# Altium schematic sheet MCU.SchDoc: Title
size A3; Date: Date; CompanyName: Integrated Micro-Electronics Bulgaria; Organization: Design & Development Department; Address1: Drawing Type; Address2: Address 1; Address3: Address 2; Address4: Address 3; DocumentNumber: 730xxx; Revision: 01; SheetNumber: 1; SheetTotal: 1; PageSetup: Record=PageOptions|CenterHorizontal=True|CenterVertical=True|PrintScale=0.70|XCorrection=1.00|YCorrection=1.00|PrintKind=2|BorderSize=5000000|LeftOffset=0|BottomOffset=0|Orientation=2|PaperLength=1000|PaperWidth=1000|Scale=100|PaperSource=7|PrintQuality=-4|MediaType=1|DitherType=10|PaperKind=A4|PrintScaleMode=1; SheetSize: A3; Time: Time; ModifiedDate: Mod. Date
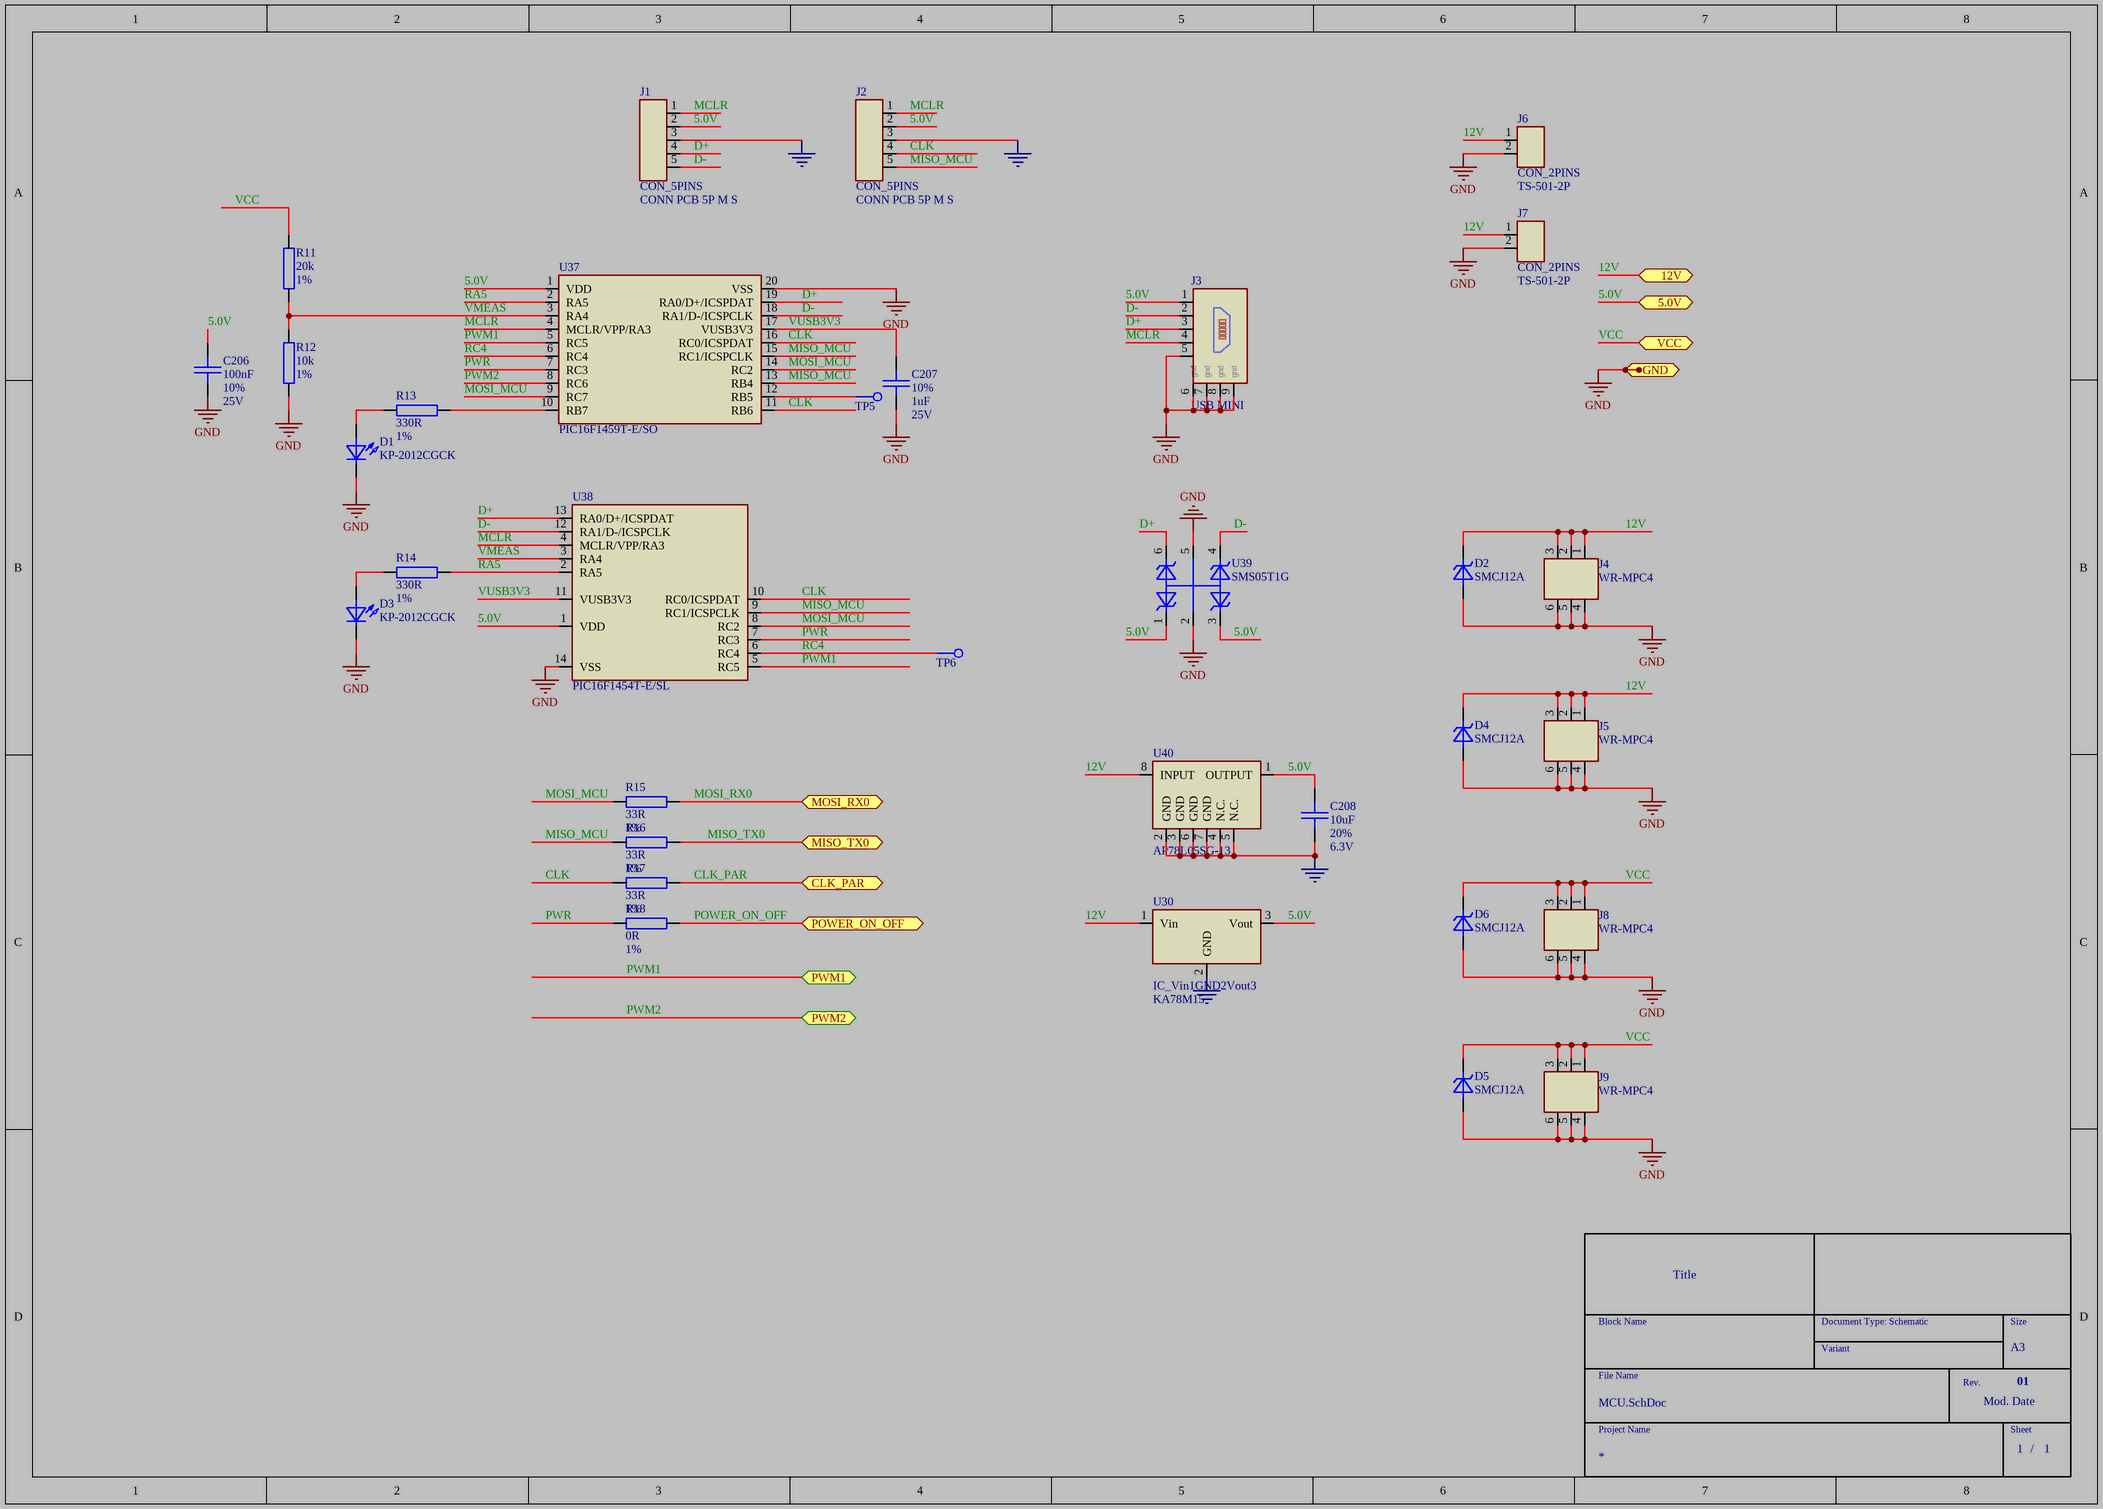
[diagram p0: MCU.SchDoc]

## Parts
C206  DB_VALUE: 100nF  DB_TOLERANCE: 10%  DB_VOLTAGE: 25V  [SMD_0402_CAPC1005X55N]  (hidden comment: C)
C207  DB_TOLERANCE: 10%  DB_VALUE: 1uF  DB_VOLTAGE: 25V  [SMD_0603_CAPC1608X80N]  (hidden comment: C)
C208  DB_VALUE: 10uF  DB_TOLERANCE: 20%  DB_VOLTAGE: 6.3V  [SMD_0603_CAPC1608X95N]  (hidden comment: C)
D1  DB_VALUE: KP-2012CGCK  [SMD_LED2012X100N]  (hidden comment: LED)
D2  DB_VALUE: SMCJ12A  [SMD_DO214AC_SMC]  (hidden comment: D_TVS_UNI)
D3  DB_VALUE: KP-2012CGCK  [SMD_LED2012X100N]  (hidden comment: LED)
D4  DB_VALUE: SMCJ12A  [SMD_DO214AC_SMC]  (hidden comment: D_TVS_UNI)
D5  DB_VALUE: SMCJ12A  [SMD_DO214AC_SMC]  (hidden comment: D_TVS_UNI)
D6  DB_VALUE: SMCJ12A  [SMD_DO214AC_SMC]  (hidden comment: D_TVS_UNI)
J1  CON_5PINS  DB_VALUE: CONN PCB 5P M S  [PTH_HDRV05W64P254_1X05]
J2  CON_5PINS  DB_VALUE: CONN PCB 5P M S  [PTH_HDRV05W64P254_1X05]
J3  DB_VALUE: USB MINI  [SMD_CON-CVILUX-CU04-SCM15B0]  (hidden comment: CON_USB_MINI_1)
J4  DB_VALUE: WR-MPC4  [PTH_CON_WR-MRC4-6P_S]  (hidden comment: CON_2ROWS_6PINS_1)
J5  DB_VALUE: WR-MPC4  [PTH_CON_WR-MRC4-6P_S]  (hidden comment: CON_2ROWS_6PINS_1)
J6  CON_2PINS  DB_VALUE: TS-501-2P  [PTH_HDRV02W11060P500_1X02]
J7  CON_2PINS  DB_VALUE: TS-501-2P  [PTH_HDRV02W11060P500_1X02]
J8  DB_VALUE: WR-MPC4  [PTH_CON_WR-MRC4-6P_S]  (hidden comment: CON_2ROWS_6PINS_1)
J9  DB_VALUE: WR-MPC4  [PTH_CON_WR-MRC4-6P_S]  (hidden comment: CON_2ROWS_6PINS_1)
R11  DB_VALUE: 20k  DB_TOLERANCE: 1%  [SMD_0603_RESC1608X55N]  (hidden comment: R)
R12  DB_VALUE: 10k  DB_TOLERANCE: 1%  [SMD_0402_RESC1005X37N]  (hidden comment: R)
R13  DB_VALUE: 330R  DB_TOLERANCE: 1%  [SMD_0603_RESC1608X55N]  (hidden comment: R)
R14  DB_VALUE: 330R  DB_TOLERANCE: 1%  [SMD_0603_RESC1608X55N]  (hidden comment: R)
R15  DB_VALUE: 33R  DB_TOLERANCE: 1%  [SMD_0402_RESC1005X37N]  (hidden comment: R)
R16  DB_VALUE: 33R  DB_TOLERANCE: 1%  [SMD_0402_RESC1005X37N]  (hidden comment: R)
R17  DB_VALUE: 33R  DB_TOLERANCE: 1%  [SMD_0402_RESC1005X37N]  (hidden comment: R)
R18  DB_VALUE: 0R  DB_TOLERANCE: 1%  [SMD_0603_RESC1608X55N]  (hidden comment: R)
TP5  TEST_POINT_1  [SMD_TP_100-254]  (value not drawn)
TP6  TEST_POINT_1  [SMD_TP_100-254]  (value not drawn)
U30  IC_Vin1GND2Vout3  DB_VALUE: KA78M15  [PTH_TO220]
U37  DB_VALUE: PIC16F1459T-E/SO  [SMD_SOIC127P1030X265-20N]  (hidden comment: IC_PIC16F1459)
U38  DB_VALUE: PIC16F1454T-E/SL  [SMD_SOIC127P600X175-14N]  (hidden comment: IC_PIC16F1454TESL-SO14)
U39  DB_VALUE: SMS05T1G  [SMD_SOT457_SOT95P275X110-6N]  (hidden comment: D_TVS_QUAD_C1A2C3C4A5C6)
U40  DB_VALUE: AP78L05SG-13  [SMD_SOIC127P600X175-8N]  (hidden comment: IC_LM2931AD-5.0R2G_SO-8)

## Ports
5.0V, 12V, CLK_PAR, GND, MISO_TX0, MOSI_RX0, POWER_ON_OFF, PWM1, PWM2, VCC

## Nets
GND: C206.2 C207.2 C208.2 D1.1(C) D2.2(A) D3.1(C) D4.2(A) D5.2(A) D6.2(A) J1.3 J2.3 J3.5 J3.6 J3.7 J3.8 J3.9 J4.4 J4.5 J4.6 J5.4 J5.5 J5.6 J6.2 J7.2 J8.4 J8.5 J8.6 J9.4 J9.5 J9.6 R12.2 U30.2(GND) U37.20(VSS) U38.14(VSS) U39.2 U39.5 U40.2(GND) U40.3(GND) U40.4(N.C.) U40.5(N.C.) U40.6(GND) U40.7(GND) ; port GND
5.0V: C206.1 C208.1 J1.2 J2.2 J3.1 U30.3(Vout) U37.1(VDD) U38.1(VDD) U39.1 U39.3 U40.1(OUTPUT) ; port 5.0V
12V: D2.1(C) D4.1(C) J4.1 J4.2 J4.3 J5.1 J5.2 J5.3 J6.1 J7.1 U30.1(Vin) U40.8(INPUT) ; port 12V
CLK: J2.4 R17.1 U37.11(RB6) U37.16(RC0/ICSPDAT) U38.10(RC0/ICSPDAT)
CLK_PAR: R17.2 ; port CLK_PAR
D+: J1.4 J3.3 U37.19(RA0/D+/ICSPDAT) U38.13(RA0/D+/ICSPDAT) U39.6
D-: J1.5 J3.2 U37.18(RA1/D-/ICSPCLK) U38.12(RA1/D-/ICSPCLK) U39.4
MCLR: J1.1 J2.1 J3.4 U37.4(MCLR/VPP/RA3) U38.4(MCLR/VPP/RA3)
MISO_MCU: J2.5 R16.1 U37.13(RB4) U37.15(RC1/ICSPCLK) U38.9(RC1/ICSPCLK)
MISO_TX0: R16.2 ; port MISO_TX0
MOSI_MCU: R15.1 U37.9(RC7) U37.14(RC2) U38.8(RC2)
MOSI_RX0: R15.2 ; port MOSI_RX0
POWER_ON_OFF: R18.2 ; port POWER_ON_OFF
PWM1: U37.5(RC5) U38.5(RC5) ; port PWM1
PWM2: U37.8(RC6) ; port PWM2
PWR: R18.1 U37.7(RC3) U38.7(RC3)
RA5: R14.2 U37.2(RA5) U38.2(RA5)
RC4: TP6.1 U37.6(RC4) U38.6(RC4)
VCC: D5.1(C) D6.1(C) J8.1 J8.2 J8.3 J9.1 J9.2 J9.3 R11.1 ; port VCC
VMEAS: R11.2 R12.1 U37.3(RA4) U38.3(RA4)
VUSB3V3: C207.1 U37.17(VUSB3V3) U38.11(VUSB3V3)
NetD1_2: D1.2(A) R13.1
NetD3_2: D3.2(A) R14.1
NetR13_2: R13.2 U37.10(RB7)
NetTP5_1: TP5.1 U37.12(RB5)

## Notes on the sheet
- Block Name
- Document Type: Schematic
- Size
- File Name
- Variant
- Rev.
- Project Name
- Sheet
- /
- (in symbol CON000000048) gnd

## Library data of the parts
C206 = CAP000047469: DB_PART_TYPE: Ceramic_SMD\Standard_X5R; DB_MANUFACTURER_PART: SAMSUNG    CL05A104KA5NNNC; NOTE: <NOTE>; DB_T_RANGE: -55 to 85; DB_PACKAGE: 0402; DB_DESCRIPTION: C X5R 100nF 10% 25V 0402; DB_APPROVED_BY: VSN; DB_STATUS: NEW; DB_PART_NUMBER: CAP000047469; DB_PCB_DEVICE: SMD_0402_CAPC1005X55N; DB_APPROVED_ON: 08.03.2016 08:26:43; DB_DATASHEET: http://john.epiqdesign.com/projects/CIS_Datasheets/CAP_CL05A104KA5NNNC_100nF_X5R_25V_10_0402_Samsung.pdf?rev=1997&sc=0
C207 = CAP000047176: DB_MANUFACTURER_PART: TDK      CGA3E1X7R1E105KT; DB_PART_TYPE: Ceramic_SMD\Standard_X7R; NOTE: <NOTE>; DB_APPROVED_BY: VSN; DB_CERTIFIED: AUT; DB_DESCRIPTION: C X7R 1uF 10% 25V 0603; DB_PACKAGE: 0603; DB_STATUS: NEW; DB_T_RANGE: -55 to 125; DB_APPROVED_ON: 12.03.2012 08:41:25; DB_DATASHEET: http://john.epiqdesign.com/projects/CIS_Datasheets/CGA4_automotive_TDK_B11.pdf?rev=502&sc=0; DB_PART_NUMBER: CAP000047176; DB_PCB_DEVICE: SMD_0603_CAPC1608X80N
C208 = CAP000043646: DB_MANUFACTURER_PART: KEMET    C0603C106M9PAC; DB_PART_TYPE: Ceramic_SMD\Standard_X5R; NOTE: <NOTE>; DB_DESCRIPTION: C X5R 10uF 20% 6.3V 0603; DB_PACKAGE: 0603; DB_STATUS: NEW; DB_T_RANGE: -55 to 85; DB_PART_NUMBER: CAP000043646; DB_APPROVED_ON: 09.10.2010; DB_DATASHEET: http://john.epiqdesign.com/projects/CIS_Datasheets/F3102_CE_Kemet.pdf?rev=92&sc=0; DB_PCB_DEVICE: SMD_0603_CAPC1608X95N
D1 D3 = OPT000000096: DB_MANUFACTURER_PART: KINGBRIGHT       KP-2012CGCK; NOTE: <NOTE>; DB_T_RANGE: -40 to 85; DB_COLOUR: GREEN; DB_PACKAGE: 0805; DB_DESCRIPTION: LED GREEN 0805; DB_APPROVED_BY: VSN; DB_STATUS: NEW; DB_PART_NUMBER: OPT000000096; DB_PART_TYPE: LED; DB_PCB_DEVICE: SMD_LED2012X100N; DB_APPROVED_ON: 08.04.2014 09:22:12; DB_DATASHEET: http://john.epiqdesign.com/projects/CIS_Datasheets/LED_KP-2012CGCK_0805_GREEN.pdf?rev=1359&sc=0
D2 D4-D6 = DDE000001725: DB_PART_TYPE: TVS; DB_MANUFACTURER_PART: Diodes        SMCJ12A; NOTE: <NOTE>; DB_T_RANGE: -55 to 150; DB_VOLTAGE: 12V; DB_CURRENT: 75A(Max); DB_PACKAGE: SMC; DB_DESCRIPTION: D SMCJ12A SMC; DB_STATUS: NEW; DB_PART_NUMBER: DDE000001725; DB_PCB_DEVICE: SMD_DO214AC_SMC; DB_APPROVED_ON: 09.10.2010
J1 J2 = CON000000006: DB_PART_TYPE: Connector; DB_MANUFACTURER_PART: W+P        143-12-005-00; NOTE: <NOTE>; DB_T_RANGE: -55 to 125; DB_PACKAGE: PTH; DB_DESCRIPTION: CONN PCB 5P M S 143-12-005-00; DB_APPROVED_BY: VSN; DB_STATUS: NEW; DB_PART_NUMBER: CON000000006; DB_PCB_DEVICE: PTH_HDRV05W64P254_1X05; DB_APPROVED_ON: 14.12.2010 10:22:07; DB_DATASHEET: http://john.epiqdesign.com/projects/CIS_Datasheets/143-12-005-00_W+P.pdf?rev=3&sc=0
J3 = CON000000048: DB_PART_TYPE: Connector; DB_MANUFACTURER_PART: CVILUX       CU04-SCM15B0-R0-LF; NOTE: <NOTE>; DB_PINS_NUMBER: 5; DB_PITCH: 0.8; DB_PACKAGE: SMD; DB_DESCRIPTION: CONN  PCB  5P  F  A  USB5 MINI SMD; DB_APPROVED_BY: VSN; DB_STATUS: NEW; DB_PART_NUMBER: CON000000048; DB_PCB_DEVICE: SMD_CON-CVILUX-CU04-SCM15B0; DB_APPROVED_ON: 02.05.2011 10:29:38; DB_DATASHEET: http://john.epiqdesign.com/projects/CIS_Datasheets/USB%20MINI_CVILUX.pdf?rev=249&sc=0
J4 J5 J8 J9 = CON000000279: DB_PART_TYPE: Connector; DB_MANUFACTURER_PART: WE        	649 006 211 22; DB_PINS_NUMBER: 6; DB_PITCH: 4.2mm; DB_T_RANGE: -40 to 105; DB_VOLTAGE: 600VAC; DB_CURRENT: 6 - 9A; DB_PACKAGE: PTH; DB_DESCRIPTION: CONN PCB 6P M S PTH; DB_APPROVED_BY: VSN; DB_STATUS: NEW; DB_PART_NUMBER: CON000000279; DB_PCB_DEVICE: PTH_CON_WR-MRC4-6P_S; DB_APPROVED_ON: 31.05.2014 08:51:24; DB_DATASHEET: http://john.epiqdesign.com/projects/CIS_Datasheets/CON_6490xx21122.pdf?rev=1438&sc=0
J6 J7 = CON000000055: DB_PART_TYPE: Connector; DB_MANUFACTURER_PART: HOW DER      TS-501-2P; NOTE: <NOTE>; DB_PINS_NUMBER: 2; DB_PITCH: 5mm; DB_VOLTAGE: 300VAC; DB_CURRENT: 10A; DB_PACKAGE: PTH; DB_DESCRIPTION: CONN PCB 2P; DB_APPROVED_BY: VSN; DB_STATUS: NEW; DB_PART_NUMBER: CON000000055; DB_PCB_DEVICE: PTH_HDRV02W11060P500_1X02; DB_APPROVED_ON: 25.08.2011 14:07:02; DB_DATASHEET: http://john.epiqdesign.com/projects/CIS_Datasheets/TS-501_HOW_DER.pdf?rev=399&sc=0
R11 = RES000006283: DB_PART_TYPE: SMD; DB_MANUFACTURER_PART: YAGEO    RC0603FR-0720K; NOTE: <NOTE>; DB_T_RANGE: -55 to 155; DB_POWER: 1/10W; DB_PACKAGE: 0603; DB_DESCRIPTION: R SMD 20K 1% 1/10W 0603; DB_CERTIFIED: AUT; DB_PRICE: 0.00063; DB_MOQ: 5000; DB_STATUS: NEW; R_BDS: R; DB_PART_NUMBER: RES000006283; DB_PCB_DEVICE: SMD_0603_RESC1608X55N; DB_PRICE_DATE: 2010-12-23; DB_APPROVED_ON: 09.10.2010; DB_DATASHEET: http://john.epiqdesign.com/projects/CIS_Datasheets/PYu-RC0603_51_RoHS_L_4_YAGEO.pdf?rev=138&sc=0
R12 = RES000008887: DB_PART_TYPE: SMD; DB_MANUFACTURER_PART: VISHAY    CRCW040210K0FKED; NOTE: <NOTE>; DB_T_RANGE: -55 to 155; DB_POWER: 1/16W; DB_PACKAGE: 0402; DB_DESCRIPTION: R SMD 10k 1% 1/16W 0402; DB_CERTIFIED: AUT; DB_PRICE: 0.00141; DB_APPROVED_BY: VSN; DB_STATUS: NEW; R_BDS: R; DB_PART_NUMBER: RES000008887; DB_PCB_DEVICE: SMD_0402_RESC1005X37N; DB_PRICE_DATE: 2013-02-07; DB_APPROVED_ON: 25.01.2013 15:35:32; DB_DATASHEET: http://john.epiqdesign.com/projects/CIS_Datasheets/Standard_Thick_Film_Chip_Resistors_AEC_Vishay.pdf?rev=362&sc=0
R13 R14 = RES000006240: DB_PART_TYPE: SMD; DB_MANUFACTURER_PART: YAGEO    RC0603FR-07330R; NOTE: <NOTE>; DB_T_RANGE: -55 to 155; DB_POWER: 1/10W; DB_PACKAGE: 0603; DB_DESCRIPTION: R SMD 330R 1% 1/10W 0603; DB_CERTIFIED: AUT; DB_PRICE: 0.00063; DB_MOQ: 5000; DB_STATUS: NEW; R_BDS: R; DB_PART_NUMBER: RES000006240; DB_PCB_DEVICE: SMD_0603_RESC1608X55N; DB_PRICE_DATE: 2010-12-23; DB_APPROVED_ON: 09.10.2010; DB_DATASHEET: http://john.epiqdesign.com/projects/CIS_Datasheets/PYu-RC0603_51_RoHS_L_4_YAGEO.pdf?rev=138&sc=0
R15-R17 = RES000005869: DB_PART_TYPE: SMD; DB_MANUFACTURER_PART: YAGEO    RC0402FR-0733R; NOTE: <NOTE>; DB_T_RANGE: -55 to 155; DB_POWER: 1/16W; DB_PACKAGE: 0402; DB_DESCRIPTION: R SMD 33R 1% 1/16W 0402; DB_CERTIFIED: AUT; DB_PRICE: 0.0006; DB_STATUS: NEW; R_BDS: R; DB_PART_NUMBER: RES000005869; DB_PCB_DEVICE: SMD_0402_RESC1005X37N; DB_PRICE_DATE: 2013-02-07; DB_APPROVED_ON: 09.10.2010; DB_DATASHEET: http://john.epiqdesign.com/projects/CIS_Datasheets/PYu-RC0402_51_RoHS_L_6_YAGEO.pdf?rev=138&sc=0
R18 = RES000008926: DB_PART_TYPE: SMD; DB_MANUFACTURER_PART: YAGEO    AC0603FR-070RL; NOTE: <NOTE>; DB_T_RANGE: -55 to 155; DB_POWER: 1/10W; DB_PACKAGE: 0603; DB_DESCRIPTION: R SMD 0R 1% 1/10W 0603; DB_CERTIFIED: AUT; DB_APPROVED_BY: VSN; DB_STATUS: NEW; R_BDS: R; DB_PART_NUMBER: RES000008926; DB_PCB_DEVICE: SMD_0603_RESC1608X55N; DB_APPROVED_ON: 21.05.2013 09:19:53; DB_DATASHEET: http://john.epiqdesign.com/projects/CIS_Datasheets/RES_AC_YAGEO.pdf?rev=263&sc=0
TP5 TP6 = TPO000000001: DB_PART_TYPE: Test Point; DB_VALUE: 100_254; DB_DESCRIPTION: Test Point 100_254; DB_STATUS: NEW; DB_PART_NUMBER: TPO000000001; DB_DIAMETER: 100_254; DB_PCB_DEVICE: SMD_TP_100-254; DB_APPROVED_ON: 10.09.2010
U30 = PSU000000080: DB_PART_TYPE: Linear Voltage Regulator; DB_MANUFACTURER_PART: FAIRCHILD        KA78M15; NOTE: <NOTE>; DB_T_RANGE: 0 to 125; DB_VOLTAGE: 15V; DB_CURRENT: 300mA(short circuit); DB_DROP_VOLTAGE: 2V; DB_PACKAGE: TO-220; DB_DESCRIPTION: IC KA78M15 TO-220; DB_APPROVED_BY: VSN; DB_STATUS: NEW; DB_PART_NUMBER: PSU000000080; DB_PCB_DEVICE: PTH_TO220; DB_APPROVED_ON: 31.07.2012 15:09:31; DB_DATASHEET: http://john.epiqdesign.com/projects/CIS_Datasheets/KA78M15_Fairchild_Linear_voltage_regulator.pdf?rev=852&sc=0
U37 = MCU000000108: DB_PART_TYPE: Microchip; DB_MANUFACTURER_PART: MICROCHIP        PIC16F1459T-E/SO; DB_T_RANGE: -40 to 125; DB_PACKAGE: SOIC-20; DB_DESCRIPTION: IC  PIC16F1459T-E/SO  SOIC-20; DB_APPROVED_BY: VSN; DB_STATUS: NEW; DB_PART_NUMBER: MCU000000108; DB_PCB_DEVICE: SMD_SOIC127P1030X265-20N; DB_APPROVED_ON: 16.01.2015 12:54:38; DB_DATASHEET: http://john.epiqdesign.com/projects/CIS_Datasheets/IC_PIC16F1459.pdf?rev=1594&sc=0
U38 = MCU000000093: DB_PART_TYPE: Microchip; DB_MANUFACTURER_PART: MICROCHIP       PIC16F1454T-E/SL; DB_T_RANGE: -40 to 125; DB_PACKAGE: SOIC-14; DB_DESCRIPTION: IC PIC16F1454T-E/SL  SOIC-14; DB_APPROVED_BY: VSN; DB_STATUS: NEW; DB_PART_NUMBER: MCU000000093; DB_PCB_DEVICE: SMD_SOIC127P600X175-14N; DB_APPROVED_ON: 24.03.2014 10:24:48; DB_DATASHEET: http://john.epiqdesign.com/projects/CIS_Datasheets/IC_PIC16F1454.pdf?rev=1324&sc=0
U39 = DDE000002846: DB_PART_TYPE: ESD protection; DB_MANUFACTURER_PART: ON SEMICONDUCTOR        SMS05T1G; DB_T_RANGE: -55 to 150; DB_VOLTAGE: 5V; DB_PACKAGE: SC-74; DB_DESCRIPTION: D SMS05T1G SC-74; DB_APPROVED_BY: VSN; DB_STATUS: NEW; DB_PART_NUMBER: DDE000002846; DB_PCB_DEVICE: SMD_SOT457_SOT95P275X110-6N; DB_APPROVED_ON: 24.03.2014 10:22:08; DB_DATASHEET: http://john.epiqdesign.com/projects/CIS_Datasheets/IC_SMS05T1-D.pdf?rev=1323&sc=0
U40 = PSU000000125: DB_PART_TYPE: Linear Voltage Regulator; DB_MANUFACTURER_PART: DIODES        AP78L05SG-13; DB_T_RANGE: -40 to 125; DB_VOLTAGE: 5V; DB_CURRENT: 100mA; DB_PACKAGE: SOIC-8; DB_DESCRIPTION: IC AP78L05SG-13 SOIC-8; DB_APPROVED_BY: VSN; DB_STATUS: NEW; DB_PART_NUMBER: PSU000000125; DB_PCB_DEVICE: SMD_SOIC127P600X175-8N; DB_APPROVED_ON: 07.05.2014 12:58:07; DB_DATASHEET: http://john.epiqdesign.com/projects/CIS_Datasheets/IC_AP78LXX.pdf?rev=1405&sc=0